# Altium schematic sheet dcb_single_input.SchDoc
size A4; SheetNumber: 7; SheetTotal: 8
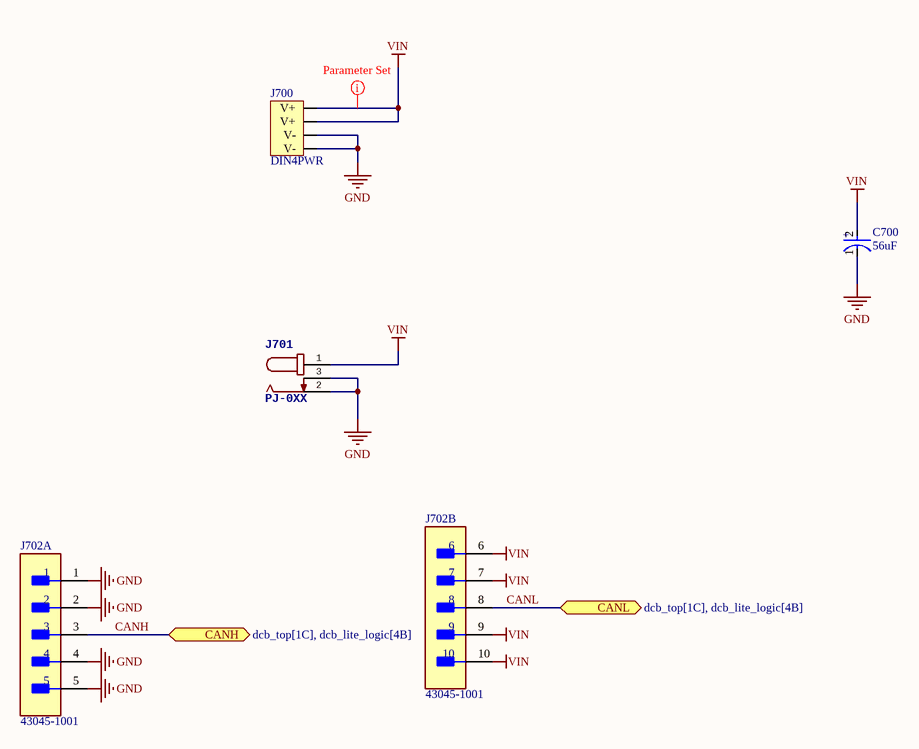
[diagram p0: dcb_single_input.SchDoc]

## Parts
C700  value 56uF  [FP-FKG-MFG]  (hidden comment: CAP 56uF 63V Poly 10mm)
J700  DIN4PWR  [PD40S]
J701  PJ-0XX  [CUI-PJ-002A_V]
J702  43045-1001  [FP-43045-1001-MFG]  (parts A,B of 2)

## Ports
CANH (bidir, see dcb_top[1C], dcb_lite_logic[4B]), CANL (bidir, see dcb_top[1C], dcb_lite_logic[4B])

## Nets
GND: C700.1(C) J700.1(V-) J700.3(V-) J701.2 J701.3 J702.1 J702.2 J702.4 J702.5
VIN: C700.2(A) J700.2(V+) J700.4(V+) J701.1 J702.6 J702.7 J702.9 J702.10
CANH: J702.3 ; port CANH
CANL: J702.8 ; port CANL

## Layout directives
net class HV: VIN

## Notes on the sheet
- Title
- Size:
- Date:
- A4
- Number:
- Time:
- Revision:
- Sheet
- of
- github.com/blueacro
- blueacro.com
- CERN OHL v2.0
- Made available under the
- File:
- © 2024 StackFoundry LLC. All Rights Reserved.
- (in symbol CMP-001-00124-1) +

## Library data of the parts
C700 = CMP-001-00124-1: Cap Aluminum 56uF 63V 20% (10 X 10.2mm) SMD 0.03 Ohm 1800mA 5000h 105 C Embossed T/R; Lead Diameter: 0.9mm; Ripple Current: 1.8A; ESR (Equivalent Series Resistance): 30mR; Material: Polymer; Leakage Current: 3uA; Life (Hours): 5000Hour; Tolerance: 20%; Diameter: 10mm; Min Operating Temperature: -55°C; Package Quantity: 500; Max Operating Temperature: 105°C; Voltage Rating (DC): 63V; Lead Pitch: 4.6mm; Ratings: AEC-Q200; Termination: SMD/SMT; Length: 10.2mm; Voltage Rating: 63V; RoHS Compliant: Yes; Ripple Current (AC): 1.8A; Series: ZA; Mounting Technology: Surface Mount,PCB; Height: 10.2mm; Radiation Hardening: No; Case/Package: Radial; Technology: HYBRID; Reach SVHC Compliant: No; Voltage: 63V; Packaging: Tape and Reel; Construction: Cylindrical; Lead Free: Lead Free
J700 = CMP-167-0005-1: Design Item ID: DIN4PWR; Source: con-jack.SCHLIB
J701 = CMP-167-0003-2: 2.0 x 6.5 mm, 2.5 A, Horizontal, Through Hole, Dc Power Jack Connector; Design Item ID: PJ-0XX; Source: con-jack.SCHLIB
J702 = CMP-002-00106-1: Connector Wire to Board Header 10 Position 3 mm Solder Right Angle Thru-Hole Micro-Fit 3.0™; Manufacturer Series: 43045; Gender: Male; DIN Conformance: No; Connector Type: Plug; Pitch: 3mm; Insulation Resistance: 1GR; Number of Contacts: 10; Glow Wire Compliant: Compliant; Voltage Rating: 600V; Voltage Rating (DC): 250V; Current Rating: 5A; Option: General Purpose; Plating: Tin; Orientation: Right Angle; Reach SVHC Compliant: No; RoHS Compliant: Yes; Flammability Rating: UL94 V-0; Contact Plating: Gold; Halogen Free: Low Halogen; Series: Micro-Fit 3.0; Packaging: Tray; Package Quantity: 1224; IEC Conformance: No; Number of Circuits: 10; MIL Conformance: No; Number of Rows: 2; Termination: Through Hole; Housing Material: Thermoplastic; Radiation Hardening: No; Row Spacing: 3mm; Contact Material: Brass; Case/Package: SMC; Number of Positions: 10; Color: Black